# Altium schematic sheet IHM.SchDoc: CONTROLADORA MAIS PIPOCA - REVISÃO EMC
size A3; DocumentNumber: GA0078; SheetNumber: 9; SheetTotal: 17
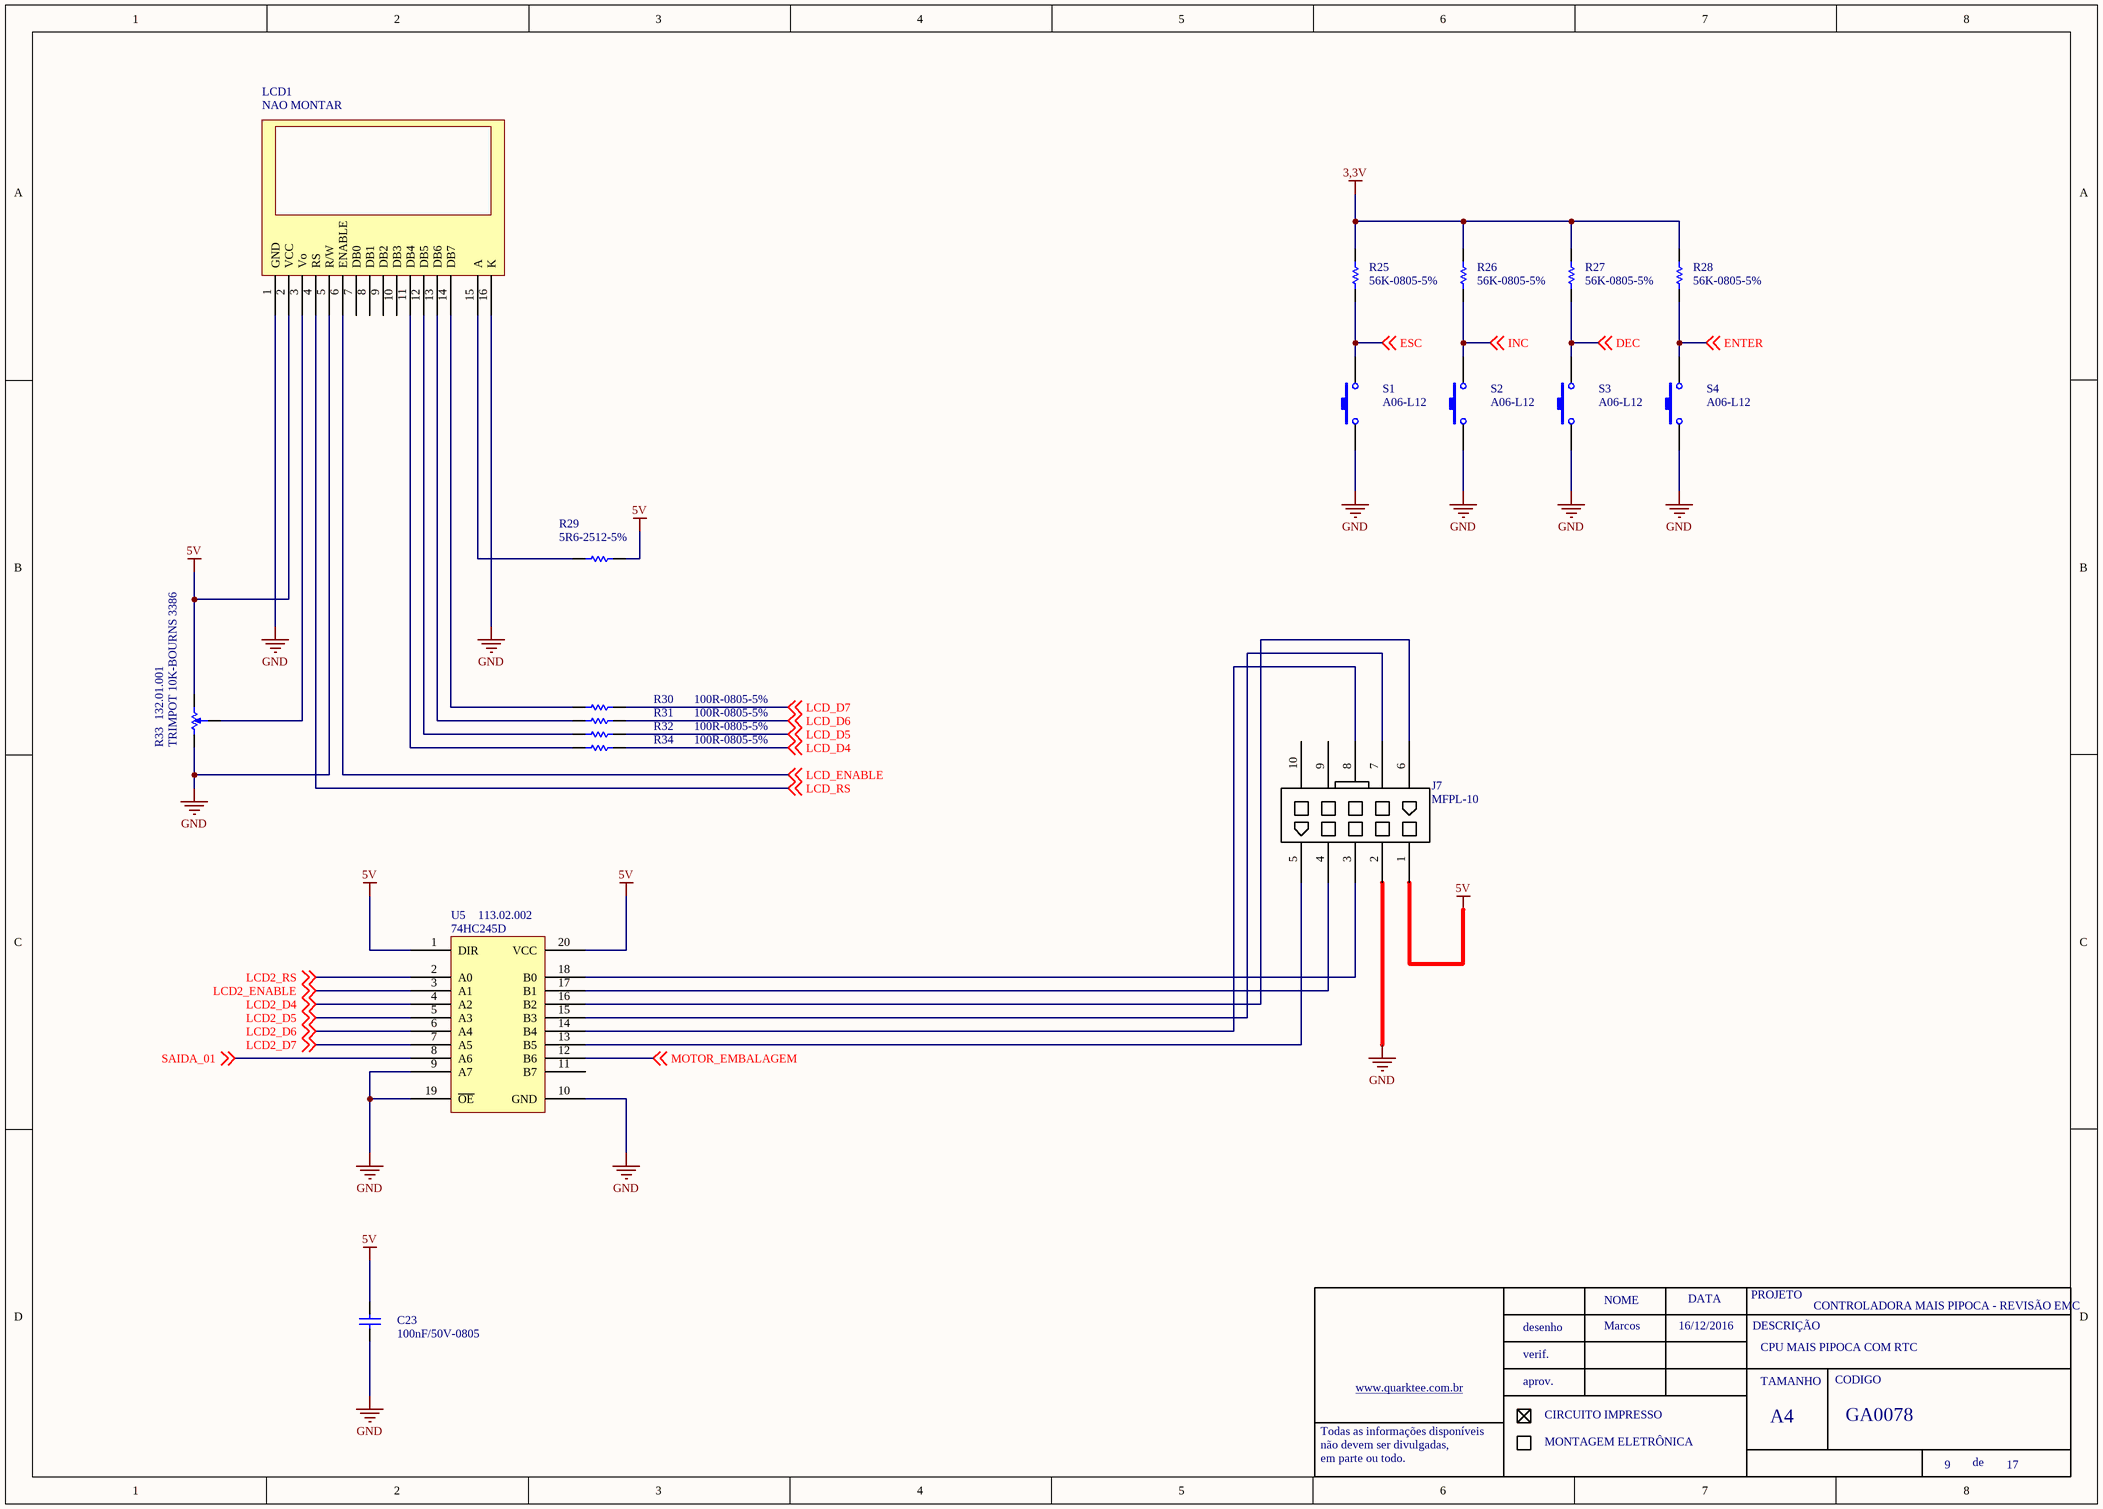
[diagram p0: IHM.SchDoc]

## Parts
C23  100nF/50V-0805  [0805-REVISADO ONDA]
J7  MFPL-10
LCD1  NAO MONTAR  [WH1602B_DS]
R25  56K-0805-5%  [0805-REVISADO ONDA]
R26  56K-0805-5%  [0805-REVISADO ONDA]
R27  56K-0805-5%  [0805-REVISADO ONDA]
R28  56K-0805-5%  [0805-REVISADO ONDA]
R29  5R6-2512-5%  [2512 - REVISADO ONDA]
R30  100R-0805-5%  [0805-REVISADO ONDA]
R31  100R-0805-5%  [0805-REVISADO ONDA]
R32  100R-0805-5%  [0805-REVISADO ONDA]
R33  TRIMPOT 10K-BOURNS 3386  ERP: 132.01.001  [TRIMPOT 3386]
R34  100R-0805-5%  [0805-REVISADO ONDA]
S1  A06-L12  [CHAVE_A06]
S2  A06-L12  [CHAVE_A06]
S3  A06-L12  [CHAVE_A06]
S4  A06-L12  [CHAVE_A06]
U5  74HC245D  ERP: 113.02.002  [SOIC-20]

## Nets
3,3V: R25.1 R26.1 R27.1 R28.1
5V: C23.2 J7.1 LCD1.2(VCC) R29.1 R33.1 U5.1(DIR) U5.20(VCC)
GND: C23.1 J7.2 LCD1.1(GND) LCD1.5(R/W) LCD1.16(K) R33.3 S1.1 S2.1 S3.1 S4.1 U5.9(A7) U5.10(GND) U5.19(~{OE})
DEC: R27.2 S3.2 ; off-sheet DEC
ENTER: R28.2 S4.2 ; off-sheet ENTER
ESC: R25.2 S1.2 ; off-sheet ESC
INC: R26.2 S2.2 ; off-sheet INC
LCD2_D4: U5.4(A2) ; off-sheet LCD2_D4
LCD2_D5: U5.5(A3) ; off-sheet LCD2_D5
LCD2_D6: U5.6(A4) ; off-sheet LCD2_D6
LCD2_D7: U5.7(A5) ; off-sheet LCD2_D7
LCD2_ENABLE: U5.3(A1) ; off-sheet LCD2_ENABLE
LCD2_RS: U5.2(A0) ; off-sheet LCD2_RS
LCD_D4: R34.2 ; off-sheet LCD_D4
LCD_D5: R32.2 ; off-sheet LCD_D5
LCD_D6: R31.2 ; off-sheet LCD_D6
LCD_D7: R30.2 ; off-sheet LCD_D7
LCD_ENABLE: LCD1.6(ENABLE) ; off-sheet LCD_ENABLE
LCD_RS: LCD1.4(RS) ; off-sheet LCD_RS
MOTOR_EMBALAGEM: U5.12(B6) ; off-sheet MOTOR_EMBALAGEM
SAIDA_01: U5.8(A6) ; off-sheet SAIDA_01
NetJ7_3: J7.3 U5.18(B0)
NetJ7_4: J7.4 U5.17(B1)
NetJ7_5: J7.5 U5.13(B5)
NetJ7_6: J7.6 U5.16(B2)
NetJ7_7: J7.7 U5.15(B3)
NetJ7_8: J7.8 U5.14(B4)
NetLCD1_3: LCD1.3(Vo) R33.2
NetLCD1_11: LCD1.11(DB4) R34.1
NetLCD1_12: LCD1.12(DB5) R32.1
NetLCD1_13: LCD1.13(DB6) R31.1
NetLCD1_14: LCD1.14(DB7) R30.1
NetLCD1_15: LCD1.15(A) R29.2

Not connected (* = marked no-connect by the designer): J7 9 10; LCD1 7(DB0) 8(DB1) 9(DB2) 10(DB3); U5 11(B7)

## Notes on the sheet
- Marcos
- 16/12/2016
- CPU MAIS PIPOCA COM RTC
- NOME
- DATA
- PROJETO
- DESCRIÇÃO
- www.quarktee.com.br
- desenho
- verif.
- aprov.
- TAMANHO
- CODIGO
- Todas as informações disponíveis
- não devem ser divulgadas,
- em parte ou todo.
- CIRCUITO IMPRESSO
- MONTAGEM ELETRÔNICA
- A4
- de

## Library data of the parts
C23 = 100nF/50-0805-NPO: ERP: 104.11.005
LCD1 = WH1602A: ERP: 131.00.001
R29 = RES 5R6-CR100: 5R6-CR100; ERP: 103.05.016
R33 = TRIMPOT 3386 50K
R25-R28 = 56K-0805-5%: ERP: 102.11.063
R30-R32 R34 = 100R-0805-5%: ERP: 102.11.031
S1-S4 = A06-L12: ERP: 136.00.001